# Altium schematic sheet deel2.SchDoc
size A4; SheetNumber: 2; SheetTotal: 4
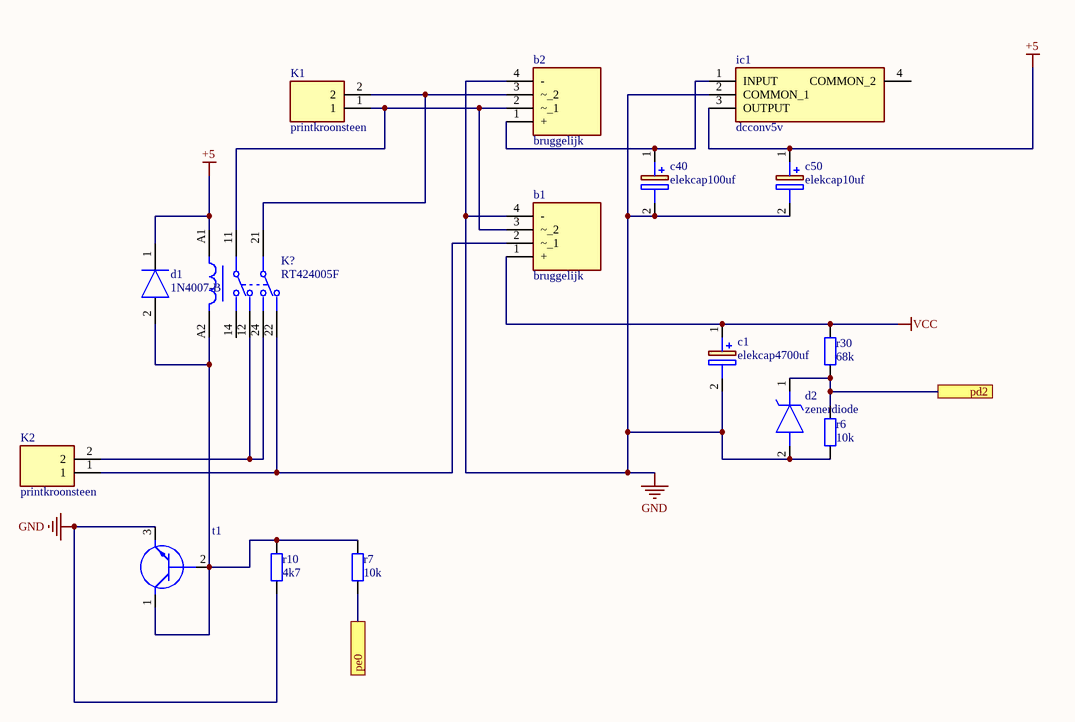
[diagram p0: deel2.SchDoc]

## Parts
b1  bruggelijk  [bruggelijk]
b2  bruggelijk  [bruggelijk]
c1  elekcap4700uf  [Elekcap4700uf]
c40  elekcap100uf  [elekcap100uf]
c50  elekcap10uf  [elekcap10uf]
d1  1N4007-B  [1n4007]
d2  zenerdiode  [zenerdiode]
ic1  dcconv5v  [dcconv5v]
K1  printkroonsteen  [printkroonsteen]
K2  printkroonsteen  [printkroonsteen]
K?  RT424005F  [FP-RT424005F-MFG]
r6  10k  [0805]
r7  10k  [0805]
r10  4k7  [0805]
r30  68k  [0805]
t1  (no value)  [bc447]

## Ports
pd2, pe0

## Nets
+5: c50.1(+) d1.1(K) ic1.3(OUTPUT) K?.A1
GND: b1.4(-) b2.4(-) c1.2(-) c40.2(-) c50.2(-) d2.2(A) ic1.2(COMMON_1) r6.1 r10.1 t1.3(E)
VCC: b1.1(+) c1.1(+) r30.2
pd2: d2.1(K) r6.2 r30.1 ; port pd2
pe0: r7.1 ; port pe0
Netb1_2: b1.2(~_1) K2.1 K?.22
Netb1_3: b1.3(~_2) b2.2(~_1) K1.1 K?.11
Netb2_1: b2.1(+) c40.1(+) ic1.1(INPUT)
Netb2_3: b2.3(~_2) K1.2 K?.21
Netd1_2: d1.2(A) K?.A2 r7.2 r10.2 t1.1(C) t1.2(B)
NetK2_2: K2.2 K?.12 K?.24

Not connected (* = marked no-connect by the designer): ic1 4(COMMON_2); K? 14

## Library data of the parts
b1 b2 = bruggelijk: Bridge Rectifier; Manufacturer_Name: Vishay; Manufacturer_Part_Number: GBU6J-E3/45; Datasheet Link: http://www.vishay.com/docs/88615/gbu6a.pdf; Height: 18.8mm
c1 = elekcap4700uf: Capacitor Polarised; Manufacturer_Name: Kemet; Manufacturer_Part_Number: ESK478M050AQ3AA; Datasheet Link: https://componentsearchengine.com//ESK478M050AQ3AA.pdf; Height: 37mm; Mouser2 Part Number: 80-ESK478M050AQ3AA; Mouser2 Price/Stock: https://www.mouser.com/Search/Refine.aspx?Keyword=80-ESK478M050AQ3AA
c40 = elekcap100uf: Capacitor Polarised; Manufacturer_Name: Kemet; Manufacturer_Part_Number: ESH107M050AG3KA; Datasheet Link: https://connect.kemet.com:7667/gateway/IntelliData-ComponentDocumentation/1.0/download/specsheet/ESH107M050AG3KA; Height: 12.5mm
c50 = elekcap10uf: Capacitor Polarised; Manufacturer_Name: Panasonic; Manufacturer_Part_Number: EEU-FR1H100; Datasheet Link: https://componentsearchengine.com//EEU-FR1H100.pdf; Height: 12.5mm; Mouser2 Part Number: 667-EEU-FR1H100; Mouser2 Price/Stock: https://www.mouser.com/Search/Refine.aspx?Keyword=667-EEU-FR1H100
d1 = 1N4007-B: Diode; Manufacturer_Name: Rectron; Datasheet Link: https://www.arrow.com/en/products/1n4007-b/rectron; Manufacturer_Part_Number: 1N4007-B
d2 = zenerdiode: Zener Diode; Manufacturer_Name: Vishay; Manufacturer_Part_Number: TZMC5V1-GS08; Datasheet Link: https://componentsearchengine.com/Datasheets/2/TZMC5V1-GS08.pdf; Height: 1.6mm
ic1 = dcconv5v: Integrated Circuit; Manufacturer_Name: Texas Instruments; Manufacturer_Part_Number: TL780-05CKTTR; Datasheet Link: http://www.ti.com/general/docs/suppproductinfo.tsp?distId=26&gotoUrl=http%3A%2F%2Fwww.ti.com%2Flit%2Fgpn%2Ftl780; Height: 5.08mm
K1 K2 = printkroonsteen: Connector; Manufacturer_Name: CUI Inc.; Manufacturer_Part_Number: TB007-508-02BE; Datasheet Link: https://componentsearchengine.com//TB007-508-02BE.pdf; Height: 14mm; Mouser2 Part Number: 490-TB007-508-02BE; Mouser2 Price/Stock: https://www.mouser.com/Search/Refine.aspx?Keyword=490-TB007-508-02BE
K? = CMP-03395-000296-1: RELAY GENERAL PURPOSE DPDT 8A 5V; Power Consumption: 400mW; Coil Current: 80.6mA; Max Voltage Rating (AC): 400V; Coil Power: 500mW; Dropout Voltage: 500mV; Operate Time: 7ms; Contact Voltage Rating (AC): 250V; Coil Type: Non-Latching; Coil Resistance: 62R; Release Time: 3ms; Max Operating Temperature: 85°C; Package Quantity: 5000; Relay Type: General Purpose; Series: RT2; Lead Free: Lead Free; Coil Voltage (DC): 5V; Contact Current Rating: 8A; Packaging: Carton; Height: 15.7mm; Mount: Through Hole; Width: 12.7mm; ELV: Compliant; Termination: PCB; Contact Material: Silver; Throw Configuration: DPDT; Min Operating Temperature: -40°C; Weight: 13g; RoHS Compliant: Yes; Length: 29mm; Radiation Hardening: No
r6 r7 r10 r30 = weerstand0805: WRIS-PSMB SMT Metal Plate Resistor, size 0805, 5mOhm, 0.5W; Manufacturer: Wurth Elektronik; Manufacturer Part Number: 580060720003; Rated Current: 10A; Temperature Coefficient of Resistance: +/-100ppm/degC; Technical Reference: MB0805R005F102KAATP0000; Resistance Tolerance: +/-1%; ComponentLink1Description: Manufacturer; ComponentLink1URL: http://www.we-online.de; ComponentLink2Description: Datasheet; ComponentLink2URL: https://www.we-online.com/catalog/datasheet/580060720003.pdf; Rated Power: 0.5W; Resistance: 5mOhm; Mounting Technology: SMT; Height: 0.35mm; Packaging: Tape and Reel; Published Date: May 2020; Size: 0805; Length: 2mm; Operating Temperature: -55 to +155degC; Width: 1.25mm
t1 = BC547CTA: Transistor BJT NPN; Manufacturer_Name: ON Semiconductor; Datasheet Link: http://www.onsemi.com/pub/Collateral/BC550-D.pdf; Manufacturer_Part_Number: BC547CTA